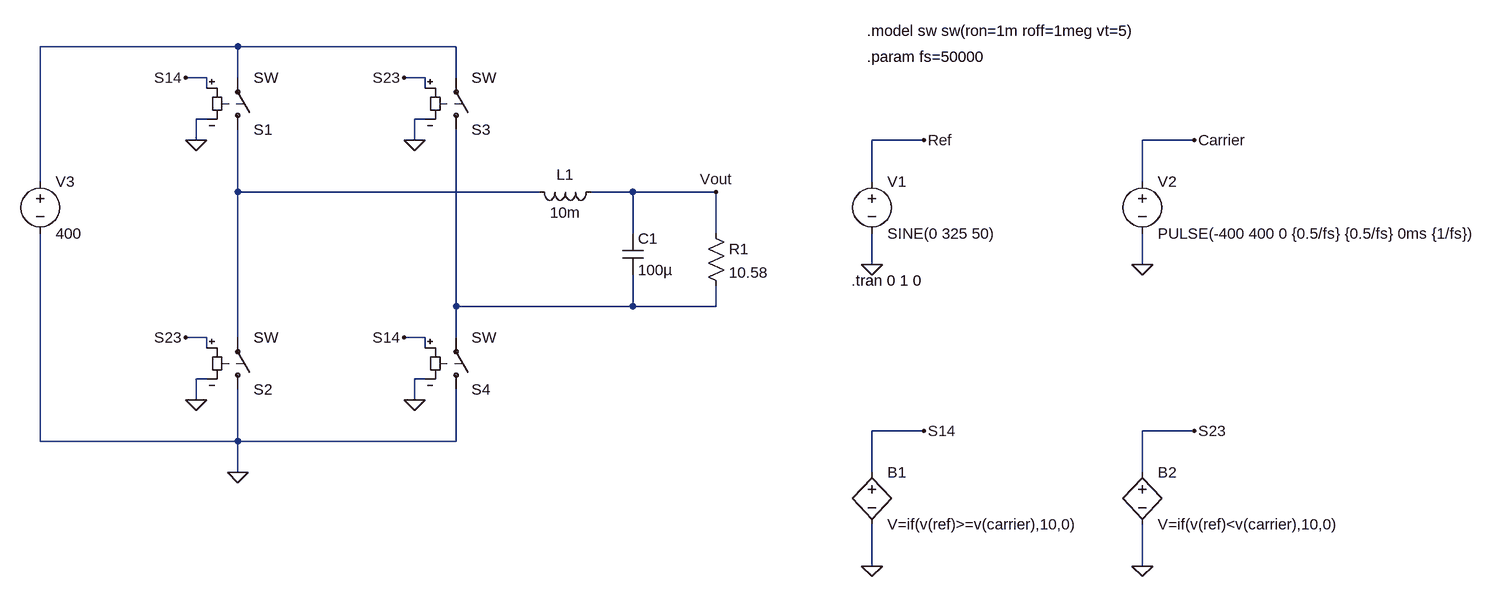
[diagram p0: schematic FullBridge_BipolarModulation.asc]
FullBridge_BipolarModulation.asc, the LTspice schematic file:
Version 4
SHEET 1 1336 680
WIRE -768 -160 -1072 -160
WIRE -432 -160 -768 -160
WIRE -816 -112 -848 -112
WIRE -768 -112 -768 -160
WIRE -480 -112 -512 -112
WIRE -432 -112 -432 -160
WIRE -816 -96 -816 -112
WIRE -480 -96 -480 -112
WIRE -816 -48 -832 -48
WIRE -480 -48 -496 -48
WIRE -832 -16 -832 -48
WIRE -496 -16 -496 -48
WIRE 288 -16 208 -16
WIRE 704 -16 624 -16
WIRE -1072 48 -1072 -160
WIRE 208 48 208 -16
WIRE 624 48 624 -16
WIRE -768 64 -768 -32
WIRE -304 64 -768 64
WIRE -160 64 -224 64
WIRE -32 64 -160 64
WIRE -160 128 -160 64
WIRE -32 128 -32 64
WIRE 208 176 208 128
WIRE 624 176 624 128
WIRE -432 240 -432 -32
WIRE -160 240 -160 192
WIRE -160 240 -432 240
WIRE -32 240 -32 208
WIRE -32 240 -160 240
WIRE -816 288 -848 288
WIRE -768 288 -768 64
WIRE -480 288 -512 288
WIRE -432 288 -432 240
WIRE -816 304 -816 288
WIRE -480 304 -480 288
WIRE -816 352 -832 352
WIRE -480 352 -496 352
WIRE -832 384 -832 352
WIRE -496 384 -496 352
WIRE 288 432 208 432
WIRE 704 432 624 432
WIRE -1072 448 -1072 128
WIRE -768 448 -768 368
WIRE -768 448 -1072 448
WIRE -432 448 -432 368
WIRE -432 448 -768 448
WIRE -768 496 -768 448
WIRE 208 496 208 432
WIRE 624 496 624 432
WIRE 208 640 208 576
WIRE 624 640 624 576
FLAG 208 176 0
FLAG 288 -16 Ref
FLAG 624 176 0
FLAG 704 -16 Carrier
FLAG 624 640 0
FLAG 208 640 0
FLAG 288 432 S14
FLAG 704 432 S23
FLAG -832 -16 0
FLAG -496 384 0
FLAG -832 384 0
FLAG -496 -16 0
FLAG -848 -112 S14
FLAG -512 288 S14
FLAG -848 288 S23
FLAG -512 -112 S23
FLAG -768 496 0
FLAG -32 64 Vout
SYMBOL voltage 208 32 R0
WINDOW 123 0 0 Left 0
WINDOW 39 0 0 Left 0
SYMATTR InstName V1
SYMATTR Value SINE(0 325 50)
SYMBOL voltage 624 32 R0
WINDOW 123 0 0 Left 0
WINDOW 39 0 0 Left 0
SYMATTR InstName V2
SYMATTR Value PULSE(-400 400 0 {0.5/fs} {0.5/fs} 0ms {1/fs})
SYMBOL bv 208 480 R0
SYMATTR InstName B1
SYMATTR Value V=if(v(ref)>=v(carrier),10,0)
SYMBOL bv 624 480 R0
SYMATTR InstName B2
SYMATTR Value V=if(v(ref)<v(carrier),10,0)
SYMBOL sw -768 -16 M180
SYMATTR InstName S1
SYMBOL sw -768 384 M180
SYMATTR InstName S2
SYMBOL sw -432 -16 M180
SYMATTR InstName S3
SYMBOL sw -432 384 M180
SYMATTR InstName S4
SYMBOL ind -208 48 R90
WINDOW 0 5 56 VBottom 2
WINDOW 3 32 56 VTop 2
SYMATTR InstName L1
SYMATTR Value 10m
SYMATTR SpiceLine Rser=100m
SYMBOL res -48 112 R0
SYMATTR InstName R1
SYMATTR Value 10.58
SYMBOL voltage -1072 32 R0
WINDOW 123 0 0 Left 0
WINDOW 39 0 0 Left 0
SYMATTR InstName V3
SYMATTR Value 400
SYMBOL cap -176 128 R0
SYMATTR InstName C1
SYMATTR Value 100µ
SYMATTR SpiceLine Rser=75m
TEXT 176 200 Left 2 !.tran 0 1 0
TEXT 200 -144 Left 2 !.param fs=50000
TEXT 200 -184 Left 2 !.model sw sw(ron=1m roff=1meg vt=5)

The netlist it stands for:
* FullBridge_BipolarModulation.asc
V1 Ref 0 SINE(0 325 50)
V2 Carrier 0 PULSE(-400 400 0 {0.5/fs} {0.5/fs} 0ms {1/fs})
B1 S14 0 V=if(v(ref)>=v(carrier),10,0)
B2 S23 0 V=if(v(ref)<v(carrier),10,0)
S1 N002 N001 S14 0 SW
S2 0 N002 S23 0 SW
S3 N003 N001 S23 0 SW
S4 0 N003 S14 0 SW
L1 Vout N002 10m Rser=100m
R1 Vout N003 10.58
V3 N001 0 400
C1 Vout N003 100µ Rser=75m
.tran 0 1 0
.param fs=50000
.model sw sw(ron=1m roff=1meg vt=5)
.backanno
.end